# EAGLE design SOIC-8 v11 (EAGLE 6.2)
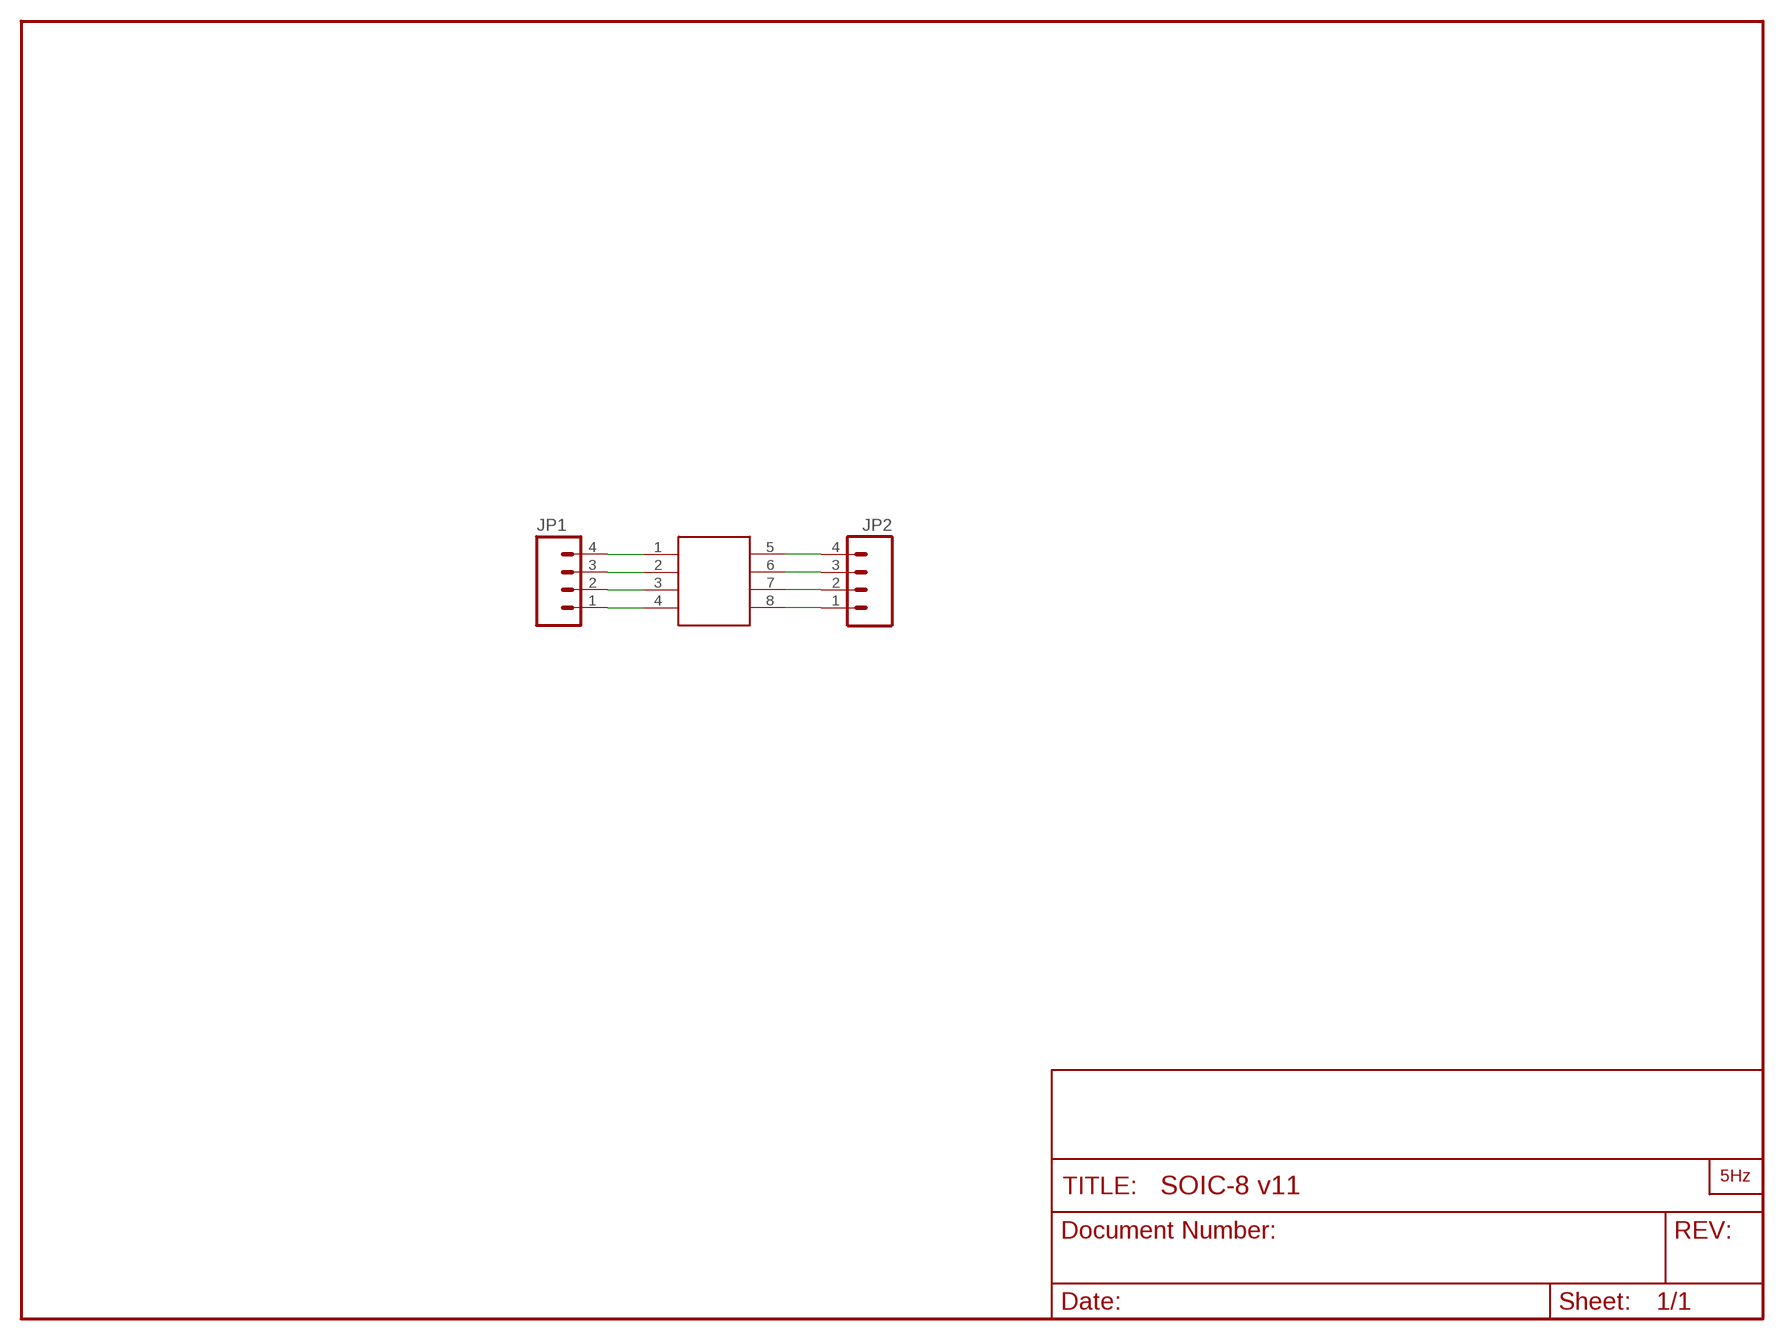
[diagram p0: schematic, sheet 1]

## Parts
JP1  M04PTH  [1X04]
JP2  M04PTH  [1X04]
U$1  SOIC8SOIC8  [SOIC8]
U$2  LOGO2_SILKC5MM  [CIRCULO2_5MM]

## Nets
N$1: JP1.1 U$1.4
N$2: JP1.2 U$1.3
N$3: JP1.3 U$1.2
N$4: JP1.4 U$1.1
N$5: JP2.1 U$1.8
N$6: JP2.2 U$1.7
N$7: JP2.3 U$1.6
N$8: JP2.4 U$1.5

## Library data of the parts
JP1 JP2 = SparkFun:M04: Header 4 Standard 4-pin 0.1" header. Use with straight break away headers (SKU : PRT-00116), right angle break away headers (PRT-00553), swiss pins (PRT-00743), machine pins (PRT-00117), and female headers (PRT-00115). Molex polarized connector foot print use with SKU : PRT-08231 with associated crimp pins and housings. 1MM SMD Version SKU: PRT-10208
U$1 = MAÑE:SOIC8
U$2 = LOGO:LOGO2_SILK: PRINCIPAL

## Board
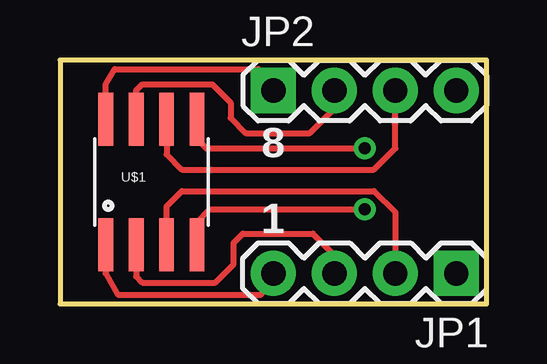
[diagram p1: board, top side]
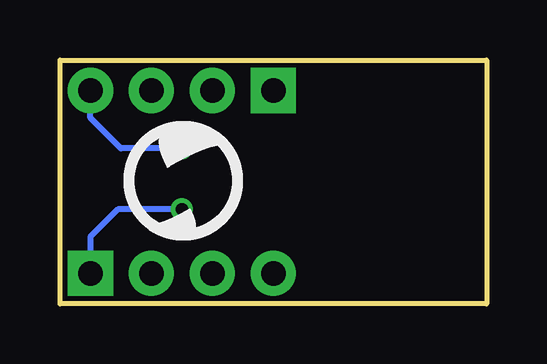
[diagram p2: board, bottom side, seen from below]

Size 17.78 x 10.16 mm. Coordinates in mm from the lower left corner, seen from the top.
Outline: 0,0 17.78,0 17.78,10.16 0,10.16 0,0
Copper layers (1*16): Top 0.035mm / dielectric 1.5mm / Bottom 0.035mm
Design rules: minimum track width 10mil, minimum drill 24mil, track to track 8mil, track to pad 8mil, pad to pad 8mil, via to via 8mil, smd to smd 8mil, copper to edge 40mil, drill to drill 8mil, minimum pad ring 10mil, minimum via ring 8mil, stop-mask expansion 4mil, vias tented up to drill 0mil, thermal gap 10mil

### Footprints (pad centres in the part's own frame; a part is rotated, then mirrored left to right if it is on the bottom)
1X04 = drill 1.016 pad 1.88 square: 1 0,0 | drill 1.016 pad 1.88: 2 2.54,0; 3 5.08,0; 4 7.62,0
SOIC8 = smd 0.61 x 2.21: 1 -1.905,-2.616; 2 -0.635,-2.616; 3 0.635,-2.616; 4 1.905,-2.616; 5 1.905,2.616; 6 0.635,2.616; 7 -0.635,2.616; 8 -1.905,2.616

### Placement (x,y rotation side)
JP1  16.51,1.27 180 top
JP2  8.89,8.89 0 top
U$1  3.81,5.08 0 top
U$2  15.11,2.67 0 bottom

### Tracks (layer width: path | path; a pad name or v marks a point on that pad's centre or on a via)
N$1  (via drill 0.51)
  Top 0.254: U$1.4 5.71,3.43 6.22,3.94 v12.7,3.94
  Bottom 0.254: v12.7,3.94 15.37,3.94 16.51,2.79 JP1.1
N$2
  Top 0.254: U$1.3 4.45,4.06 5.08,4.7 13.08,4.7 13.97,3.81 JP1.2
N$3
  Top 0.254: U$1.2 3.17,1.14 3.43,0.89 6.48,0.89 7.24,1.65 7.24,2.54 7.62,2.92 10.54,2.92 11.43,2.03 JP1.3
N$4
  Top 0.254: U$1.1 1.91,1.27 2.41,0.38 8.38,0.38 JP1.4
N$5
  Top 0.254: U$1.8 1.91,9.14 2.29,9.78 8.26,9.78 JP2.1
N$6
  Top 0.254: U$1.7 3.17,8.89 3.43,9.14 6.35,9.14 7.11,8.38 7.11,7.75 7.75,7.11 10.41,7.11 11.43,8.13 JP2.2
N$7
  Top 0.254: U$1.6 4.45,6.22 5.08,5.59 13.08,5.59 13.97,6.48 JP2.3
N$8  (via drill 0.51)
  Top 0.254: U$1.5 5.71,6.86 6.1,6.48 v12.7,6.48
  Bottom 0.254: v12.7,6.48 15.24,6.48 16.51,7.75 JP2.4

### Text on the board
tPlace: 8 | 1